# EAGLE design SC2_Schem (EAGLE 7.0.0)
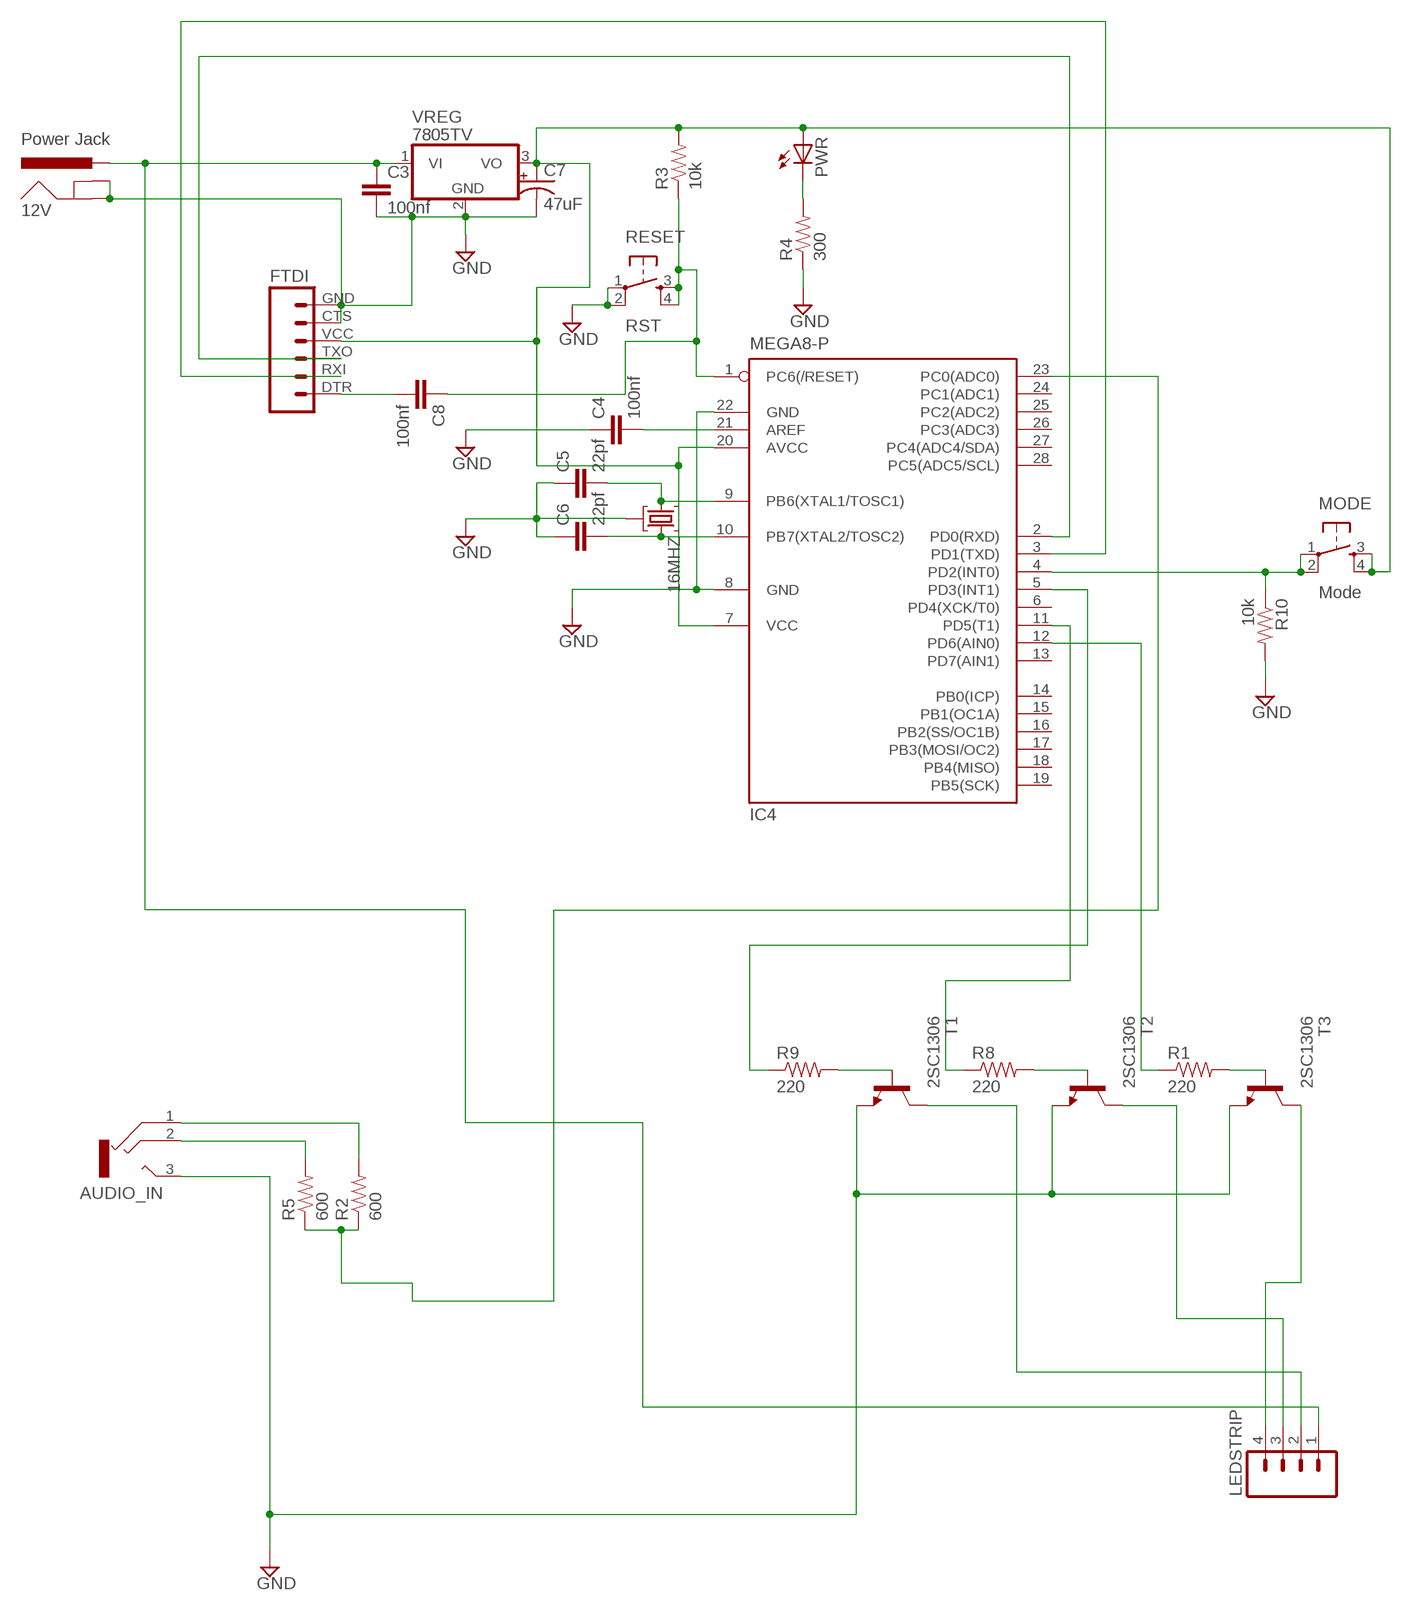
[diagram p0: schematic, sheet 1]

## Parts
12V  Power Jack  POWER_JACKPTH  [POWER_JACK_PTH]
16MHZ  10G7A-12.5KHZ  [HC49U]
AUDIO_IN  1503_04  [1503_04]
C3  100nf  CAPPTH1  [CAP-PTH-5MM]
C4  100nf  CAPPTH1  [CAP-PTH-5MM]
C5  22pf  CAPPTH1  [CAP-PTH-5MM]
C6  22pf  CAPPTH1  [CAP-PTH-5MM]
C7  47uF  CAP_POLPTH1  [CPOL-RADIAL-100UF-25V]
C8  100nf  CAPPTH1  [CAP-PTH-5MM]
FTDI  FTDI_BASICPTH  [FTDI_BASIC]
IC4  MEGA8-P  [DIL28-3]
LEDSTRIP  M041X04_NO_SILK  [1X04_NO_SILK]
MODE  Mode  TAC_SWITCHPTH  [TACTILE-PTH]
PWR  LED5MM  [LED5MM]
R1  220  RESISTORAXIAL-0.3  [AXIAL-0.3]
R2  600  RESISTORAXIAL-0.3  [AXIAL-0.3]
R3  10k  RESISTOREZ  [AXIAL-0.3EZ]
R4  300  RESISTOREZ  [AXIAL-0.3EZ]
R5  600  RESISTORAXIAL-0.3  [AXIAL-0.3]
R8  220  RESISTORAXIAL-0.3  [AXIAL-0.3]
R9  220  RESISTORAXIAL-0.3  [AXIAL-0.3]
R10  10k  RESISTORAXIAL-0.3  [AXIAL-0.3]
RESET  RST  TAC_SWITCHPTH  [TACTILE-PTH]
T1  2SC1306  [TO220BV]
T2  2SC1306  [TO220BV]
T3  2SC1306  [TO220BV]
VREG  7805TV  [TO220V]

## Nets
GND: 12V.GND 12V.GNDBREAK 16MHZ.2 AUDIO_IN.3 C3.2 C4.1 C5.1 C6.1 C7.2(-) FTDI.CTS FTDI.GND IC4.8(GND) IC4.22(GND) R4.P$1 R10.P$2 RESET.1 RESET.2 T1.3(E) T2.3(E) T3.3(E) VREG.2(GND)
N$1: R9.P$2 T1.1(B)
N$2: IC4.23(PC0(ADC0)) R2.P$1 R5.P$1
N$3: C4.2 IC4.21(AREF)
N$4: PWR.K(C) R4.P$2
N$5: R8.P$2 T2.1(B)
N$6: AUDIO_IN.1 R2.P$2
N$7: R1.P$2 T3.1(B)
N$8: IC4.5(PD3(INT1)) R9.P$1
N$9: IC4.11(PD5(T1)) R8.P$1
N$10: 16MHZ.1 C5.2 IC4.9(PB6(XTAL1/TOSC1))
N$11: 16MHZ.3 C6.2 IC4.10(PB7(XTAL2/TOSC2))
N$12: AUDIO_IN.2 R5.P$2
N$15: C8.1 IC4.1(PC6(/RESET)) R3.P$1 RESET.3 RESET.4
N$16: FTDI.TXO IC4.2(PD0(RXD))
N$17: FTDI.RXI IC4.3(PD1(TXD))
N$18: C8.2 FTDI.DTR
N$20: IC4.12(PD6(AIN0)) R1.P$1
N$21: IC4.4(PD2(INT0)) MODE.1 MODE.2 R10.P$1
N$22: LEDSTRIP.2 T1.2(C)
N$23: LEDSTRIP.3 T2.2(C)
N$24: LEDSTRIP.4 T3.2(C)
N$38: C7.1(+) FTDI.VCC IC4.7(VCC) IC4.20(AVCC) MODE.3 MODE.4 PWR.A R3.P$2 VREG.3(VO)
V+: 12V.PWR C3.1 LEDSTRIP.1 VREG.1(VI)
Unconnected: IC4.6(PD4(XCK/T0)) IC4.13(PD7(AIN1)) IC4.14(PB0(ICP)) IC4.15(PB1(OC1A)) IC4.16(PB2(SS/OC1B)) IC4.17(PB3(MOSI/OC2)) IC4.18(PB4(MISO)) IC4.19(PB5(SCK)) IC4.24(PC1(ADC1)) IC4.25(PC2(ADC2)) IC4.26(PC3(ADC3)) IC4.27(PC4(ADC4/SDA)) IC4.28(PC5(ADC5/SCL))

## Library data of the parts
12V = SparkFun-Connectors:POWER_JACK: Power Jack This is the standard 5.5mm barrel jack for power. The PTH is the most common, proven, reliable, footprint. The Slot footprint only works if the mill layer is transmitted to the PCB fab house so be warned. Mating wall wart : TOL-00298 (and others); PROD_ID: PRT-00119
16MHZ = crystal:10G: Monolithic Crystal Filters Source: www.golledge.com; OC_FARNELL: unknown; OC_NEWARK: unknown
AUDIO_IN = con-lumberg:1503_04: Jack connectors according to JISC 6560, 3.5 mm, IP 57 Klinkensteckverbinder nach JISC 6560, 3,5 mm, IP 57 Source: http://www.lumberg.com/Produkte/PDFs/1503_04.pdf; OC_FARNELL: 1216981; OC_NEWARK: unknown
C3-C6 C8 = SparkFun-Capacitors:CAP: Capacitor Standard 0603 ceramic capacitor, and 0.1" leaded capacitor.
C7 = SparkFun-Capacitors:CAP_POL: Capacitor Polarized These are standard SMD and PTH capacitors. Normally 10uF, 47uF, and 100uF in electrolytic and tantalum varieties. Always verify the external diameter of the through hole cap, it varies with capacity, voltage, and manufacturer. The EIA devices should be standard.
FTDI = SparkFun-Connectors:FTDI_BASIC: FTDI Basic header with labels
IC4 = atmel:MEGA8-P: MICROCONTROLLER 8 Kbytes FLASH, 1 kbytes SRAM, 512 bytes EEPROM, USART, 4-channel 10 bit ADC, 2-channel 8 bit ADC Pin compatible with Atmega48, ATMega88, ATMega168 Source: avr.lbr; OC_FARNELL: unknown; OC_NEWARK: unknown
LEDSTRIP = SparkFun-Connectors:M04: Header 4 Standard 4-pin 0.1" header. Use with straight break away headers (SKU : PRT-00116), right angle break away headers (PRT-00553), swiss pins (PRT-00743), machine pins (PRT-00117), and female headers (PRT-00115). Molex polarized connector foot print use with SKU : PRT-08231 with associated crimp pins and housings. 1MM SMD Version SKU: PRT-10208
MODE RESET = SparkFun-Electromechanical:TAC_SWITCH: Momentary Switch Button commonly used for reset or general input. Spark Fun Electronics SKU : COM-00097 SMT- SWCH-08247
PWR = adafruit:LED: LED OSRAM: - CHIPLED LG R971, LG N971, LY N971, LG Q971, LY Q971, LO R971, LY R971 LH N974, LH R974 LS Q976, LO Q976, LY Q976 LO Q996 - Hyper CHIPLED LW Q18S LB Q993, LB Q99A, LB R99A - SideLED LS A670, LO A670, LY A670, LG A670, LP A670 LB A673, LV A673, LT A673, LW A673 LH A674 LY A675 LS A676, LA A676, LO A676, LY A676, LW A676 LS A679, LY A679, LG A679 - Hyper Micro SIDELED® LS Y876, LA Y876, LO Y876, LY Y876 LT Y87S - SmartLED LW L88C, LW L88S LB L89C, LB L89S, LG L890 LS L89K, LO L89K, LY L89K LS L896, LA L896, LO L896, LY L896 - TOPLED LS T670, LO T670, LY T670, LG T670, LP T670 LSG T670, LSP T670, LSY T670, LOP T670, LYG T670 LG T671, LOG T671, LSG T671 LB T673, LV T673, LT T673, LW T673 LH T674 LS T676, LA T676, LO T676, LY T676, LB T676, LH T676, LSB T676, LW T676 LB T67C, LV T67C, LT T67C, LS T67K, LO T67K, LY T67K, LW E67C LS E67B, LA E67B, LO E67B, LY E67B, LB E67C, LV E67C, LT E67C LW T67C LS T679, LY T679, LG T679 LS T770, LO T770, LY T770, LG T770, LP T770 LB T773, LV T773, LT T773, LW T773 LH T774 LS E675, LA E675, LY E675, LS T675 LS T776, LA T776, LO T776, LY T776, LB T776 LHGB T686 LT T68C, LB T68C - Hyper Mini TOPLED® LB M676 - Mini TOPLED Santana® LG M470 LS M47K, LO M47K, LY M47K Source: http://www.osram.convergy.de/
R1-R5 R8-R10 = SparkFun-Passives:RESISTOR: Resistor Basic schematic elements and footprints for 0603, 1206, and PTH resistors.
T1-T3 = transistor:2SC1306: NPN Transistor Final RF Power Outupt Source: 2sc1306.pdf
VREG = linear:78*: Positive VOLTAGE REGULATOR Source: http://cache.national.com/ds/LM/LM78L05.pdf http://www.fairchildsemi.com/ds/LM/LM7805.pdf

## Board
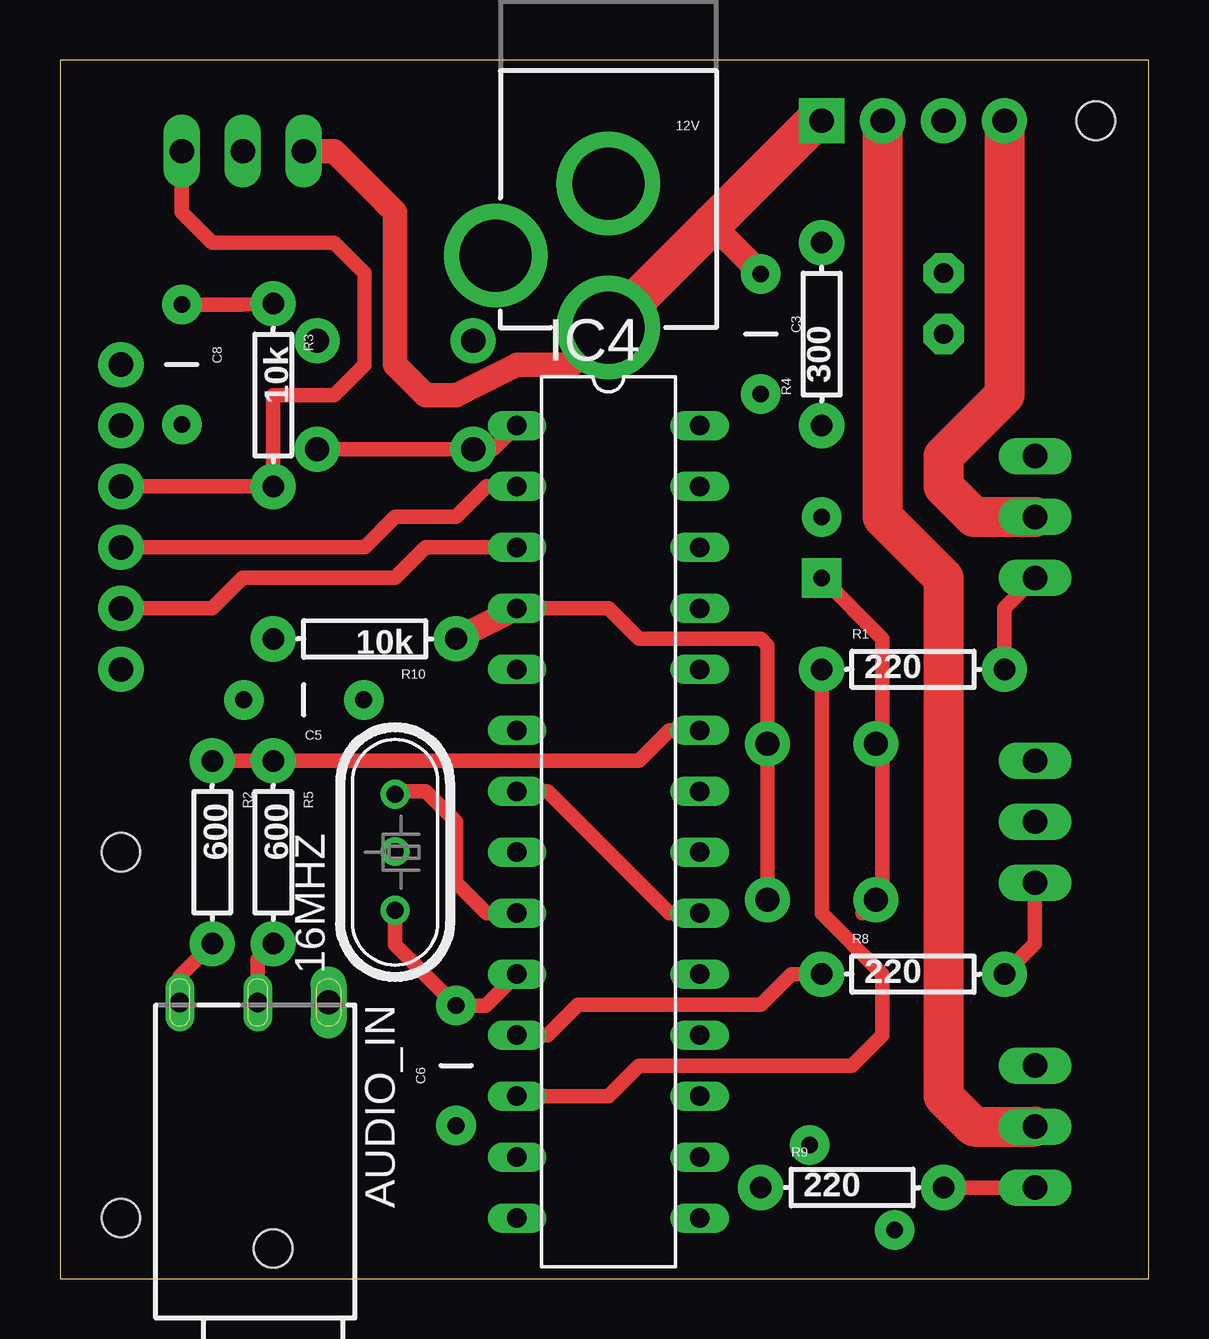
[diagram p1: board, top side]
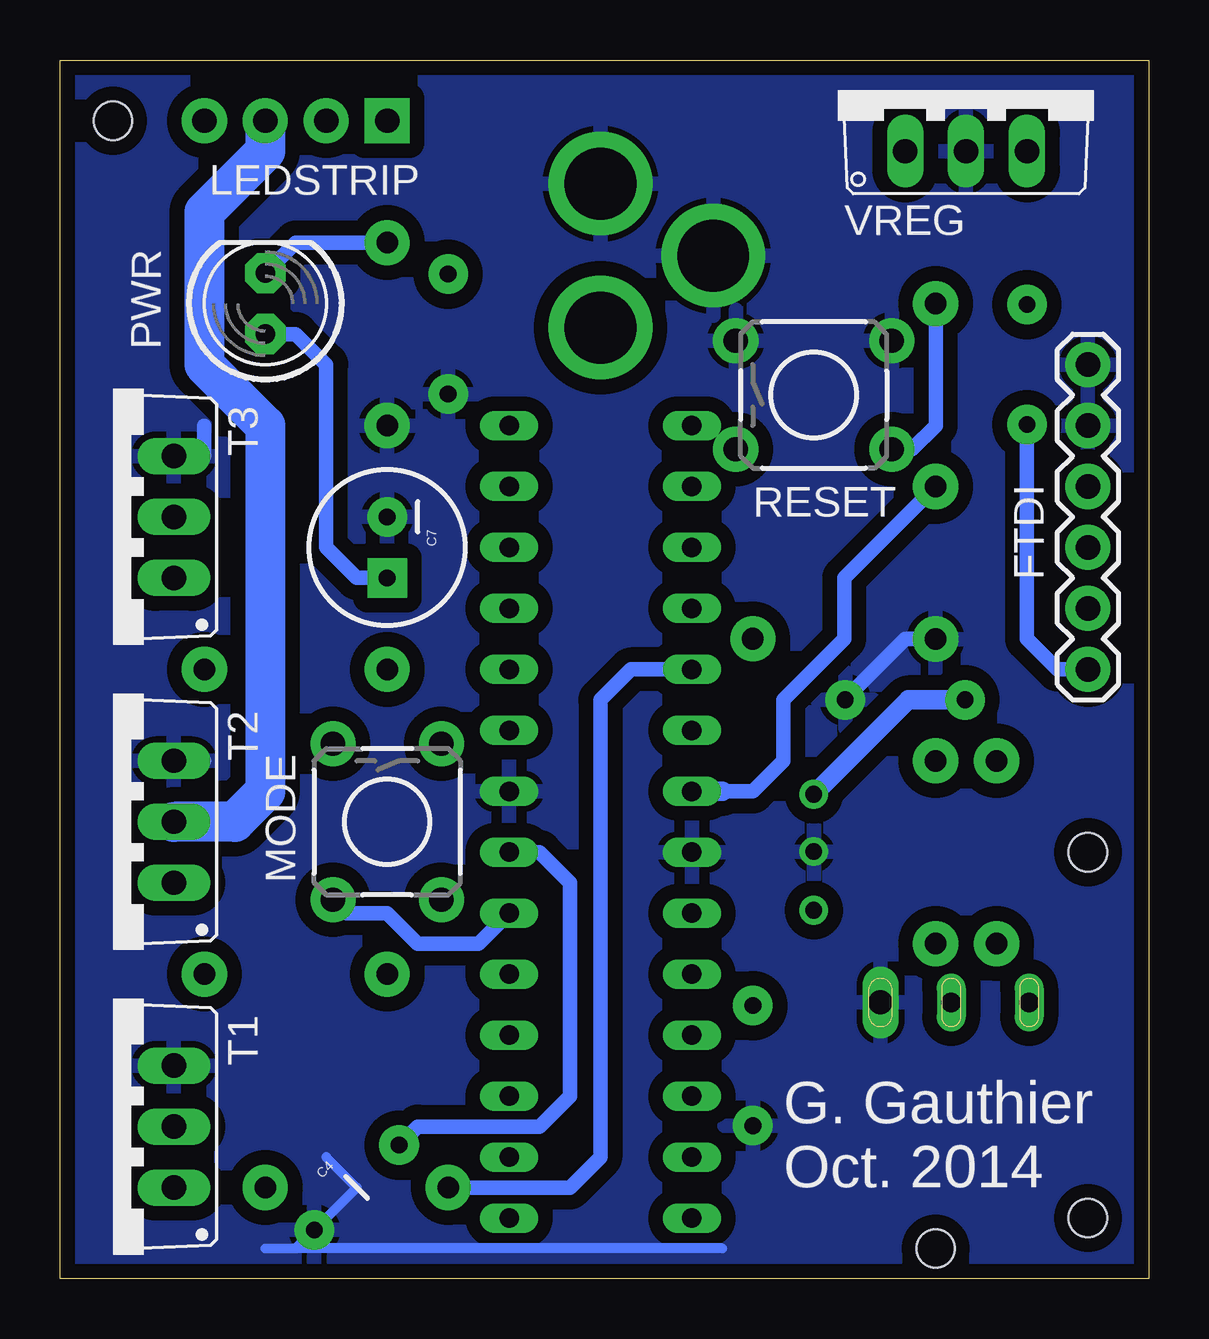
[diagram p2: board, bottom side, seen from below]

Size 45.39 x 50.79 mm. Coordinates in mm from the lower left corner, seen from the top.
Outline: 0,0 45.39,0 45.39,50.79 0,50.79 0,0
Copper layers (1*16): Top 0.0356mm / dielectric 1.5011mm / Bottom 0.0356mm
Design rules "OSHPark": minimum track width 6mil, minimum drill 13mil, track to track 6mil, track to pad 6mil, pad to pad 6mil, via to via 6mil, smd to smd 6mil, copper to edge 15mil, drill to drill 6mil, minimum pad ring 7mil, minimum via ring 7mil, stop-mask expansion 3mil, vias tented up to drill 0mil, thermal gap 10mil
Holes 1.6 mm at 43.18,48.26 2.54,2.54 2.54,17.78

### Footprints (pad centres in the part's own frame; a part is rotated, then mirrored left to right if it is on the bottom)
POWER_JACK_PTH = drill 2.997 pad 4.318: GND 0,7.7; GNDBREAK 4.7,10.7; PWR 0,13.7
HC49U = drill 0.7 pad 1.2: 1 -2.413,0; 2 -0.027,0; 3 2.413,0
1503_04 = drill 0.8 pad 1.2 long: 1 3.9,-10.25; 2 0.65,-10.25 | drill 1 pad 1.2 long: 3 -2.3,-10.25 | hole 1.6: 0,0
CAP-PTH-5MM = drill 0.7 pad 1.651: 1 -2.5,0; 2 2.5,0
CPOL-RADIAL-100UF-25V = drill 0.7 pad 1.651 square: 1 1.27,0 | drill 0.7 pad 1.651: 2 -1.27,0
FTDI_BASIC = drill 1.016 pad 1.88: CTS 10.16,0; DTR 0,0; GND 12.7,0; RXI 2.54,0; TXO 5.08,0; VCC 7.62,0
DIL28-3 = drill 0.813 long: 1 -16.51,-3.81; 2 -13.97,-3.81; 3 -11.43,-3.81; 4 -8.89,-3.81; 5 -6.35,-3.81; 6 -3.81,-3.81; 7 -1.27,-3.81; 8 1.27,-3.81; 9 3.81,-3.81; 10 6.35,-3.81; 11 8.89,-3.81; 12 11.43,-3.81; 13 13.97,-3.81; 14 16.51,-3.81; 15 16.51,3.81; 16 13.97,3.81; 17 11.43,3.81; 18 8.89,3.81; 19 6.35,3.81; 20 3.81,3.81; 21 1.27,3.81; 22 -1.27,3.81; 23 -3.81,3.81; 24 -6.35,3.81; 25 -8.89,3.81; 26 -11.43,3.81; 27 -13.97,3.81; 28 -16.51,3.81
1X04_NO_SILK = drill 1.016 pad 1.88 square: 1 0,0 | drill 1.016 pad 1.88: 2 2.54,0; 3 5.08,0; 4 7.62,0
TACTILE-PTH = drill 1.016 pad 1.88: 1 -3.251,2.261; 2 3.251,2.261; 3 -3.251,-2.261; 4 3.251,-2.261
LED5MM = drill 0.813 pad 1.676 octagon: A -1.27,0; K 1.27,0
AXIAL-0.3 = drill 0.9 pad 1.88: P$1 -3.81,0; P$2 3.81,0
AXIAL-0.3EZ = drill 0.9 pad 1.88: P$1 -3.81,0; P$2 3.81,0
TO220BV = drill 1.016 long: 1 -2.54,-2.54; 2 0,-2.54; 3 2.54,-2.54
TO220V = drill 1.016 long: 1 -2.54,-2.54; 2 0,-2.54; 3 2.54,-2.54

### Placement (x,y rotation side)
12V  22.86,53.34 180 top
16MHZ  13.97,17.78 270 top
AUDIO_IN  8.89,1.27 180 top
C3  29.21,39.37 270 top
C4  33.02,3.81 45 bottom
C5  10.16,24.13 180 top
C6  16.51,8.89 90 top
C7  31.75,30.48 270 bottom
C8  5.08,38.1 270 top
FTDI  2.54,25.4 90 bottom
IC4  22.86,19.05 270 top
LEDSTRIP  31.75,48.26 180 bottom
MODE  31.75,19.05 270 bottom
PWR  36.83,40.64 90 bottom
R1  35.56,25.4 0 top
R2  6.35,17.78 270 top
R3  8.89,36.83 270 top
R4  31.75,39.37 90 top
R5  8.89,17.78 270 top
R8  35.56,12.7 0 top
R9  33.02,3.81 0 top
R10  12.7,26.67 180.1 top
RESET  13.97,36.83 0 bottom
T1  43.18,6.35 90 bottom
T2  43.18,19.05 90 bottom
T3  43.18,31.75 90 bottom
VREG  7.62,49.53 0 bottom

### Tracks (layer width: path | path; a pad name or v marks a point on that pad's centre or on a via)
GND
  Bottom 0.406: 17.78,1.27 35.56,1.27 | 36.83,1.27 35.56,1.27 | 35.56,1.27 33.02,3.81 34.29,5.08
  Bottom 0.61: C5.1 12.66,24.17 10.16,26.67 R10.P$2 | T2.3 39.37,21.59 | T3.3 39.37,34.29 39.37,35.56
  pour Bottom (isolate 0.61): 0,50.8 45.72,50.8 45.72,0 0,0
N$1
  Top 0.61: R9.P$2 T1.1
N$2
  Top 0.61: R2.P$1 R5.P$1 24.13,21.59 25.4,22.86 IC4.23
N$3
  Bottom 0.61: IC4.21 25.4,17.78 24.13,16.51 24.13,7.62 25.4,6.35 30.48,6.35 C4.2
N$4
  Bottom 0.61: R4.P$2 35.56,43.18 PWR.K
N$5
  Top 0.61: R8.P$2 40.64,13.97 T2.1
N$6
  Top 0.61: AUDIO_IN.1 4.99,12.61 R2.P$2
N$7
  Top 0.61: R1.P$2 39.37,27.94 T3.1
N$8
  Bottom 0.61: IC4.5 21.59,25.4 22.86,24.13 22.86,5.08 24.13,3.81 R9.P$1
N$9
  Top 0.61: IC4.11 20.32,10.16 21.59,11.43 29.21,11.43 30.48,12.7 R8.P$1
N$10
  Top 0.61: IC4.9 17.78,15.24 16.51,16.51 16.51,19.05 15.24,20.32 14.1,20.32 16MHZ.1
  Bottom 0.813: C5.2 10.03,24.13 16MHZ.1
N$11
  Top 0.61: 16MHZ.3 13.97,13.93 C6.2 17.74,11.39 IC4.10
N$12
  Top 0.61: AUDIO_IN.2 8.24,13.32 R5.P$2
N$15
  Top 0.61: C8.1 7.58,40.6 R3.P$1 | RESET.4 RESET.3 18.06,34.57 IC4.1
  Bottom 0.61: RESET.4 9.88,34.57 8.89,35.56 R3.P$1
N$16
  Top 0.61: IC4.2 17.78,33.02 16.51,31.75 13.97,31.75 12.7,30.48 FTDI.TXO
N$17
  Top 0.61: FTDI.RXI 6.35,27.94 7.62,29.21 13.97,29.21 15.24,30.48 IC4.3
N$18
  Bottom 0.61: C8.2 5.08,26.67 3.81,25.4 FTDI.DTR
N$20
  Top 0.61: IC4.12 22.86,7.62 24.13,8.89 33.02,8.89 34.29,10.16 34.29,12.7 31.75,15.24 R1.P$1
N$21
  Top 0.61: MODE.2 MODE.1 29.49,26.39 29.21,26.67 24.13,26.67 22.86,27.94 IC4.4
  Top 1.016: R10.P$1 IC4.4
N$22
  Top 1.676: T1.2 38.1,6.35 36.83,7.62 36.83,29.21 34.29,31.75 LEDSTRIP.2
N$23
  Bottom 1.676: LEDSTRIP.3 36.83,46.99 39.37,44.45 39.37,38.1 36.83,35.56 36.83,20.32 38.1,19.05 T2.2
N$24
  Top 1.676: LEDSTRIP.4 39.37,36.83 36.83,34.29 36.83,33.02 38.1,31.75 T3.2
N$38
  Top 0.61: FTDI.VCC R3.P$2 8.89,36.83 11.43,36.83 12.7,38.1 12.7,41.91 11.43,43.18 6.35,43.18 5.08,44.45 VREG.3 | 34.29,22.02 34.29,16.08 MODE.4 33.45,15.24 | 34.29,22.02 MODE.3 | 34.29,22.02 34.29,26.67 C7.1 | IC4.7 20.32,20.32 25.4,15.24 IC4.20
  Bottom 0.61: IC4.20 27.94,13.97 30.48,13.97 31.75,15.24 33.45,15.24 MODE.4 | 17.78,20.32 16.51,20.32 15.24,21.59 15.24,24.13 12.7,26.67 12.7,29.21 R3.P$2 | C7.1 33.02,29.21 34.29,30.48 34.29,38.1 35.56,39.37 PWR.A
  Bottom 0.813: IC4.7 17.78,20.32
V+
  Top 1.016: C3.1 29.21,41.91 27.17,43.95 | VREG.1 11.43,46.99 13.97,44.45 13.97,38.1 15.24,36.83 16.51,36.83 19.05,38.1 21.32,38.1 12V.PWR
  Top 1.676: LEDSTRIP.1 31.48,48.26 27.17,43.95 12V.PWR

### Text on the board
bNames: G. Gauthier / Oct. 2014